# Altium schematic sheet STM32最小系统.SchDoc
size A4
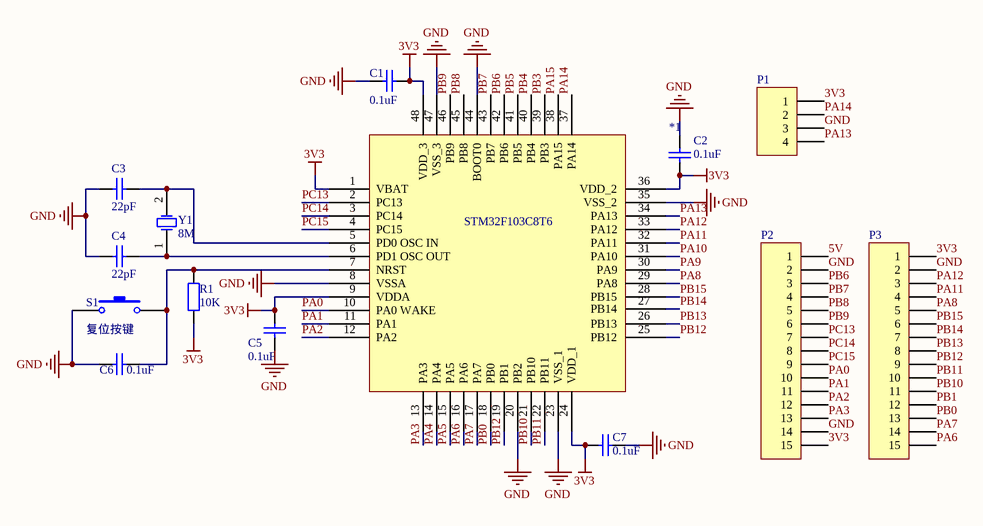
[diagram p0: STM32最小系统.SchDoc]

## Parts
*1  STM32F103C8T6
C1  value 0.1uF  [RAD-0.3]  (hidden comment: Cap)
C2  value 0.1uF  [RAD-0.3]  (hidden comment: Cap)
C3  value 22pF  [RAD-0.3]  (hidden comment: Cap)
C4  value 22pF  [RAD-0.3]  (hidden comment: Cap)
C5  value 0.1uF  [RAD-0.3]  (hidden comment: Cap)
C6  value 0.1uF  [RAD-0.3]  (hidden comment: Cap)
C7  value 0.1uF  [RAD-0.3]  (hidden comment: Cap)
P1  MHDR1X4  [MHDR1X4]  (value not drawn)
P2  MHDR1X15  [MHDR1X15]  (value not drawn)
P3  MHDR1X15  [MHDR1X15]  (value not drawn)
R1  value 10K  [AXIAL-0.4]  (hidden comment: Res2)
S1  复位按键  [SPST-2]
Y1  8M  [R38]

## Nets
3V3: *1.1(VBAT) *1.9(VDDA) *1.24(VDD_1) *1.36(VDD_2) *1.48(VDD_3) C1.2 C2.1 C5.2 C7.1 P1.1 P2.15 P3.1 R1.1
GND: *1.8(VSSA) *1.20(PB2) *1.23(VSS_1) *1.35(VSS_2) *1.44(BOOT0) *1.47(VSS_3) C1.1 C2.2 C3.2 C4.2 C5.1 C6.2 C7.2 P1.3 P2.2 P2.14 P3.2 S1.1
5V: P2.1
PA0: *1.10(PA0_WAKE) P2.10
PA1: *1.11(PA1) P2.11
PA2: *1.12(PA2) P2.12
PA3: *1.13(PA3) P2.13
PA4: *1.14(PA4)
PA5: *1.15(PA5)
PA6: *1.16(PA6) P3.15
PA7: *1.17(PA7) P3.14
PA8: *1.29(PA8) P3.5
PA9: *1.30(PA9)
PA10: *1.31(PA10)
PA11: *1.32(PA11) P3.4
PA12: *1.33(PA12) P3.3
PA13: *1.34(PA13) P1.4
PA14: *1.37(PA14) P1.2
PA15: *1.38(PA15)
PB0: *1.18(PB0) P3.13
PB1: P3.12
PB3: *1.39(PB3)
PB4: *1.40(PB4)
PB5: *1.41(PB5)
PB6: *1.42(PB6) P2.3
PB7: *1.43(PB7) P2.4
PB8: *1.45(PB8) P2.5
PB9: *1.46(PB9) P2.6
PB10: *1.21(PB10) P3.11
PB11: *1.22(PB11) P3.10
PB12: *1.19(PB1) *1.25(PB12) P3.9
PB13: *1.26(PB13) P3.8
PB14: *1.27(PB14) P3.7
PB15: *1.28(PB15) P3.6
PC13: *1.2(PC13) P2.7
PC14: *1.3(PC14) P2.8
PC15: *1.4(PC15) P2.9
Net*1_5: *1.5(PD0_OSC_IN) C3.1 Y1.2(OSC2)
Net*1_6: *1.6(PD1_OSC_OUT) C4.1 Y1.1(OSC1)
Net*1_7: *1.7(NRST) C6.1 R1.2 S1.2

## Library data of the parts
C1-C7 = Cap: Capacitor; Published: 8-Jun-2000; LatestRevisionDate: 17-Jul-2002; LatestRevisionNote: Re-released for DXP Platform.; PackageReference: RAD-0.3; Publisher: Altium Limited; PackageDescription: Radial Cap, Thru-Hole; 2 Leads; 0.3 in Pin Spacing
P1 = MHDR1X4: Header, 4-Pin; LatestRevisionDate: 17-Jul-2002; LatestRevisionNote: Re-released for DXP Platform.; Publisher: Altium Limited
P2 P3 = MHDR1X15: Header, 15-Pin; LatestRevisionDate: 17-Jul-2002; LatestRevisionNote: Re-released for DXP Platform.; Publisher: Altium Limited
R1 = Res2: Resistor; Published: 8-Jun-2000; LatestRevisionDate: 17-Jul-2002; LatestRevisionNote: Re-released for DXP Platform.; PackageReference: AXIAL-0.4; Publisher: Altium Limited; PackageDescription: Axial Device, Thru-Hole; 2 Leads; 0.4 in Pin Spacing
S1 = SW-PB: Switch; Published: 24-Mar-1999; LatestRevisionDate: 17-Jul-2002; LatestRevisionNote: Re-released for DXP Platform.; PackageReference: SPST-2; Publisher: Altium Limited; PackageDescription: Switch; 2 Leads
Y1 = XTAL: Crystal Oscillator; Published: 8-Jun-2000; LatestRevisionDate: 17-Jul-2002; LatestRevisionNote: Re-released for DXP Platform.; PackageReference: R38; Publisher: Altium Limited; PackageDescription: Crystal, Thru-Hole; 2 Leads; Body 3.1 x 8.2 mm (Dia.xH)